# Altium schematic sheet driver_V1.5.SchDoc
size A4
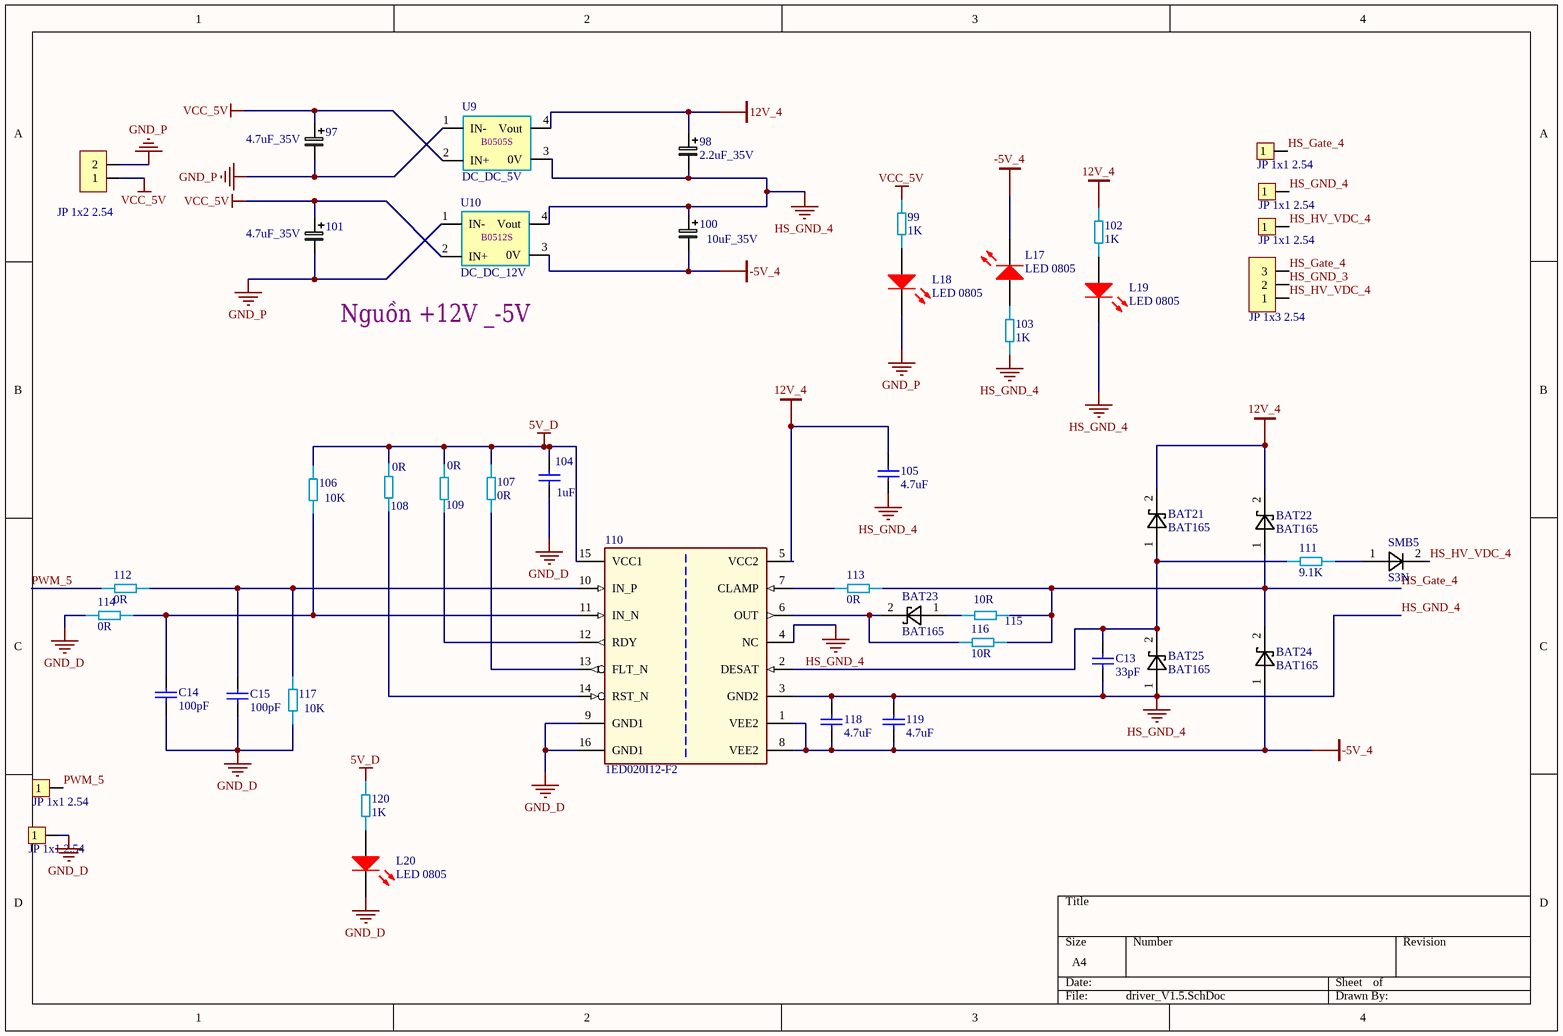
[diagram p0: driver_V1.5.SchDoc]

## Parts
97  4.7uF_35V  [tu_4x5.4mm]
98  2.2uF_35V  [tu_4x5.4mm]
99  1K  [RES1206]
100  10uF_35V  [tu_4x5.4mm]
101  4.7uF_35V  [tu_4x5.4mm]
102  1K  [RES1206]
103  1K  [RES1206]
104  1uF  [Tu 0805_N]
105  4.7uF  [tu 1206_N]
106  10K  [RES1206]
107  0R  [RES1206]
108  0R  [RES1206]
109  0R  [RES1206]
110  1ED020I12-F2  [SOIC127P1028X264-16N-1]
111  9.1K  [RES_2512]
112  0R  [RES1206]
113  0R  [RES_2512]
114  0R  [RES1206]
115  10R  [RES_2512]
116  10R  [RES_2512]
117  10K  [RES1206]
118  4.7uF  [tu 1206_N]
119  4.7uF  [tu 1206_N]
120  1K  [RES1206]
BAT21  BAT165  [SMB]
BAT22  BAT165  [SMB]
BAT23  BAT165  [SMB]
BAT24  BAT165  [SMB]
BAT25  BAT165  [SMB]
C13  33pF  [Tu 0805_N]
C14  100pF  [Tu 0805_N]
C15  100pF  [Tu 0805_N]
JP30  JP 1x1 2.54  [test_point]
JP31  JP 1x2 2.54  [JP 1x2 DT_n]
JP32  JP 1x1 2.54  [test_point]
JP33  JP 1x1 2.54  [test_point]
JP34  JP 1x3 2.54  [XH2.54M-3]
JP35  JP 1x1 2.54  [test_point]
JP36  JP 1x1 2.54  [test_point]
L17  LED 0805  [LED-0805-Red]
L18  LED 0805  [LED-0805-Red]
L19  LED 0805  [LED-0805-Red]
L20  LED 0805  [LED-0805-Red]
SMB5  S3N  [SMB]
U9  DC_DC_5V  [B0505S/D-1W]
U10  DC_DC_12V  [B0512S/D-1W]

## Nets
5V_D: 104.2 106.2 107.1 108.2 109.1 110.15(VCC1) 120.1
12V_4: 98.1 102.1 105.2 110.5(VCC2) BAT21.2 BAT22.2 U9.4(Vout)
-5V_4: 100.2 110.1(VEE2) 110.8(VEE2) 118.1 119.1 BAT24.1 L17.2(K) U10.3(0V)
GND_D: 104.1 110.9(GND1) 110.16(GND1) 114.2 117.1 C14.1 C15.1 JP36.1 L20.2(K)
GND_P: 97.2 101.2 JP31.2 L18.2(K) U9.1(IN-) U10.1(IN-)
HS_GND_4: 98.2 100.1 103.2 105.1 110.3(GND2) 110.4(NC) 118.2 119.2 BAT25.1 C13.1 JP32.1 L19.2(K) U9.3(0V) U10.4(Vout)
VCC_5V: 97.1 99.1 101.1 JP31.1 U9.2(IN+) U10.2(IN+)
HS_Gate_4: 113.2 115.2 116.2 BAT22.1 BAT24.2 JP30.1 JP34.3
HS_GND_3: JP34.2
HS_HV_VDC_4: JP33.1 JP34.1 SMB5.2
PWM_5: 112.2 JP35.1
Net99_2: 99.2 L18.1(A)
Net102_2: 102.2 L19.1(A)
Net103_1: 103.1 L17.1(A)
Net106_1: 106.1 110.11(IN_N) 114.1 C14.2
Net107_2: 107.2 110.13(FLT_N)
Net108_1: 108.1 110.14(RST_N)
Net109_2: 109.2 110.12(RDY)
Net110_2: 110.2(DESAT) 111.1 BAT21.1 BAT25.2 C13.2
Net110_6: 110.6(OUT) 116.1 BAT23.2
Net110_7: 110.7(CLAMP) 113.1
Net110_10: 110.10(IN_P) 112.1 117.2 C15.2
Net111_2: 111.2 SMB5.1
Net115_1: 115.1 BAT23.1
Net120_2: 120.2 L20.1(A)

## Notes on the sheet
- Nguồn +12V _-5V
- (in symbol DC_DC_5v) B0505S
- (in symbol DC_DC_12v) B0512S

## Library data of the parts
97 98 100 101 = capacitor_electric
99 102 103 106-109 111-117 120 = 311-0.0GRTR-ND
104 C13-C15 = cap_0805
105 118 119 = cap_1210
110 = 1ED020I12-F2: Single IGBT Driver IC; Manufacturer: Infineon Technologies; Manufacturer Order Number: 1ED020I12-F2; PackageReference: PG-DSO-16-15
JP30 JP32 JP33 JP35 JP36 = JP 1x1 2.54 Duc Thang: Cắm; Ten_Linh_Kien: Jump Đơn Đực 2.54MM 1x40P Thẳng 11MM; Don_Vi: Con; Ma_Hang: MH000903; Ghi_Chu: *; Kieu_Chan: *; Chung_Loai: Cắm
JP31 = JP 1x2 2.54 Duc Thang: Cắm; Ten_Linh_Kien: Jump Đơn Đực 2.54MM 1x40P Thẳng 11MM; Don_Vi: Con; Ma_Hang: MH000903; Ghi_Chu: *; Kieu_Chan: *; Chung_Loai: Cắm
JP34 = JP 1x3 2.54 Duc Cong: Cắm; Ten_Linh_Kien: Jump Đơn Đực 2.54MM 1x40P Cong Đứng; Don_Vi: Con; Ma_Hang: MH000904; Ghi_Chu: *; Kieu_Chan: *; Chung_Loai: Cắm
L17-L20 = LED 0805 Do: Dán; Don_Vi: Con; Ma_Hang: MH000897; Ten_Linh_Kien: LED 0805 Màu Đỏ (Red); Ghi_Chu: *; Kieu_Chan: *; Chung_Loai: Dán
SMB5 = S3A-S3N